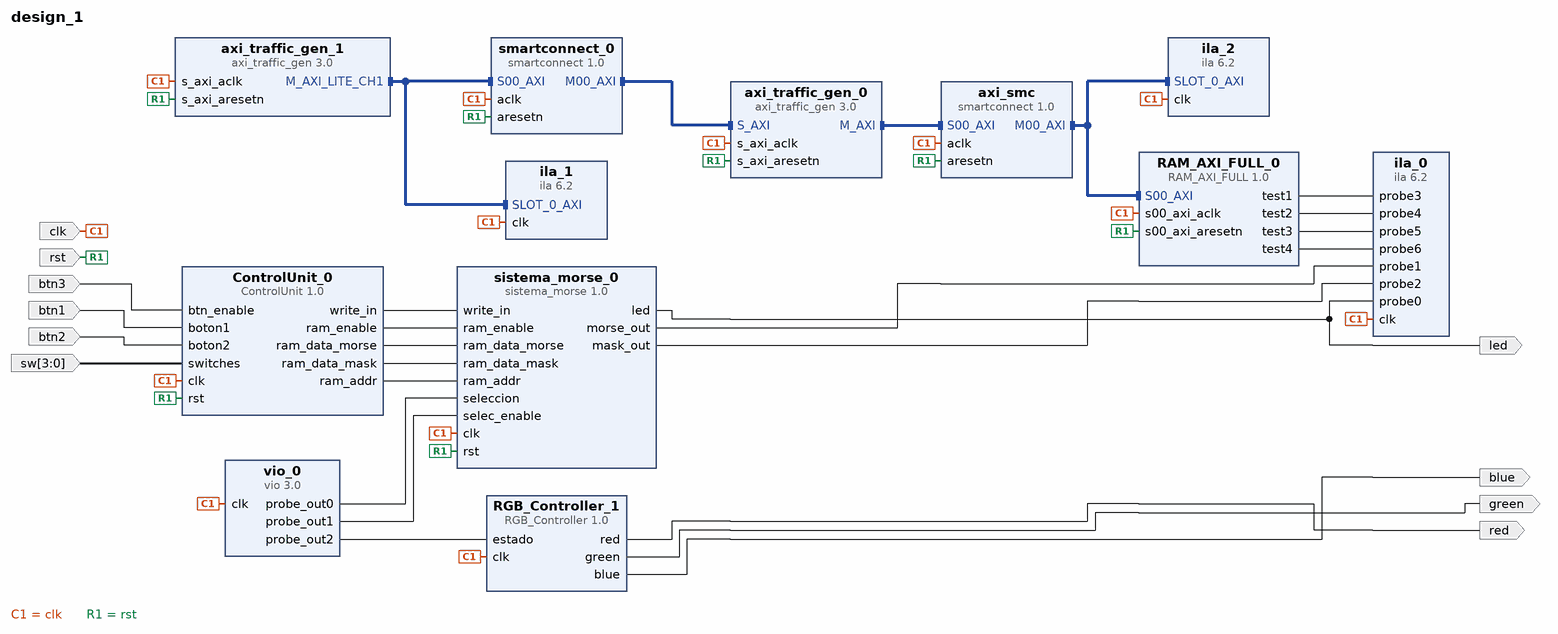
[diagram p0: block diagram of the top level]
# Vivado block design design_1, xc7z010clg400-1, Vivado 2020.1
create_bd_design design_1

create_bd_port -dir I -type clk clk
create_bd_port -dir I -type rst rst
create_bd_port -dir I btn3
create_bd_port -dir I btn1
create_bd_port -dir I btn2
create_bd_port -dir I -from 3 -to 0 sw
create_bd_port -dir O led
create_bd_port -dir O red
create_bd_port -dir O green
create_bd_port -dir O blue

create_bd_cell -type ip -vlnv xilinx.com:ip:vio:3.0 vio_0
set_property -dict [list \
  CONFIG.C_NUM_PROBE_IN 0 \
  CONFIG.C_NUM_PROBE_OUT 3 \
  CONFIG.C_PROBE_OUT0_WIDTH 6 \
  CONFIG.C_PROBE_OUT2_WIDTH 4 \
] [get_bd_cells vio_0]
create_bd_cell -type ip -vlnv xilinx.com:ip:ila:6.2 ila_0
set_property -dict [list \
  CONFIG.C_ENABLE_ILA_AXI_MON false \
  CONFIG.C_MONITOR_TYPE Native \
  CONFIG.C_NUM_OF_PROBES 7 \
  CONFIG.C_PROBE1_WIDTH 5 \
  CONFIG.C_PROBE2_WIDTH 5 \
  CONFIG.C_PROBE3_WIDTH 10 \
  CONFIG.C_PROBE4_WIDTH 10 \
  CONFIG.C_PROBE5_WIDTH 10 \
  CONFIG.C_PROBE6_WIDTH 10 \
] [get_bd_cells ila_0]
create_bd_cell -type ip -vlnv xilinx.com:ip:axi_traffic_gen:3.0 axi_traffic_gen_0
create_bd_cell -type ip -vlnv xilinx.com:ip:axi_traffic_gen:3.0 axi_traffic_gen_1
set_property -dict [list \
  CONFIG.C_ATG_MODE AXI4-Lite \
  CONFIG.C_ATG_SYSINIT_MODES System_Test \
  CONFIG.C_ATG_SYSTEM_CMD_MAX_RETRY 2147483647 \
  CONFIG.C_ATG_SYSTEM_INIT_ADDR_MIF ../../../../../../../support/addr.coe \
  CONFIG.C_ATG_SYSTEM_INIT_CTRL_MIF ../../../../../../../support/ctrl.coe \
  CONFIG.C_ATG_SYSTEM_INIT_DATA_MIF ../../../../../../../support/data.coe \
  CONFIG.C_ATG_SYSTEM_INIT_MASK_MIF ../../../../../../../support/mask.coe \
] [get_bd_cells axi_traffic_gen_1]
create_bd_cell -type ip -vlnv xilinx.com:ip:smartconnect:1.0 smartconnect_0
set_property -dict {CONFIG.NUM_SI 1} [get_bd_cells smartconnect_0]
create_bd_cell -type ip -vlnv xilinx.com:ip:ila:6.2 ila_1
create_bd_cell -type ip -vlnv xilinx.com:ip:smartconnect:1.0 axi_smc
set_property -dict {CONFIG.NUM_SI 1} [get_bd_cells axi_smc]
create_bd_cell -type ip -vlnv xilinx.com:user:RAM_AXI_FULL:1.0 RAM_AXI_FULL_0
create_bd_cell -type ip -vlnv xilinx.com:user:ControlUnit:1.0 ControlUnit_0
create_bd_cell -type ip -vlnv xilinx.com:user:RGB_Controller:1.0 RGB_Controller_1
create_bd_cell -type ip -vlnv xilinx.com:user:sistema_morse:1.0 sistema_morse_0
create_bd_cell -type ip -vlnv xilinx.com:ip:ila:6.2 ila_2

# ---- connections ----

connect_bd_intf_net [get_bd_intf_pins axi_traffic_gen_1/M_AXI_LITE_CH1] [get_bd_intf_pins smartconnect_0/S00_AXI]
connect_bd_intf_net [get_bd_intf_pins axi_traffic_gen_1/M_AXI_LITE_CH1] [get_bd_intf_pins ila_1/SLOT_0_AXI]
connect_bd_intf_net [get_bd_intf_pins smartconnect_0/M00_AXI] [get_bd_intf_pins axi_traffic_gen_0/S_AXI]
connect_bd_intf_net [get_bd_intf_pins axi_traffic_gen_0/M_AXI] [get_bd_intf_pins axi_smc/S00_AXI]
connect_bd_intf_net [get_bd_intf_pins axi_smc/M00_AXI] [get_bd_intf_pins RAM_AXI_FULL_0/S00_AXI]
connect_bd_intf_net [get_bd_intf_pins axi_smc/M00_AXI] [get_bd_intf_pins ila_2/SLOT_0_AXI]
connect_bd_net -net clk_0_1 [get_bd_ports clk] \
  [get_bd_pins vio_0/clk] [get_bd_pins ila_0/clk] [get_bd_pins axi_traffic_gen_1/s_axi_aclk] \
  [get_bd_pins smartconnect_0/aclk] [get_bd_pins axi_traffic_gen_0/s_axi_aclk] [get_bd_pins ila_1/clk] \
  [get_bd_pins axi_smc/aclk] [get_bd_pins RAM_AXI_FULL_0/s00_axi_aclk] [get_bd_pins ControlUnit_0/clk] \
  [get_bd_pins RGB_Controller_1/clk] [get_bd_pins sistema_morse_0/clk] [get_bd_pins ila_2/clk]
connect_bd_net -net rst_0_1 [get_bd_ports rst] \
  [get_bd_pins axi_traffic_gen_1/s_axi_aresetn] [get_bd_pins smartconnect_0/aresetn] \
  [get_bd_pins axi_traffic_gen_0/s_axi_aresetn] [get_bd_pins axi_smc/aresetn] [get_bd_pins RAM_AXI_FULL_0/s00_axi_aresetn] \
  [get_bd_pins ControlUnit_0/rst] [get_bd_pins sistema_morse_0/rst]
connect_bd_net -net btn_enable_0_1 [get_bd_ports btn3] [get_bd_pins ControlUnit_0/btn_enable]
connect_bd_net -net boton1_0_1 [get_bd_ports btn1] [get_bd_pins ControlUnit_0/boton1]
connect_bd_net -net boton2_0_1 [get_bd_ports btn2] [get_bd_pins ControlUnit_0/boton2]
connect_bd_net -net switches_0_1 [get_bd_ports sw] [get_bd_pins ControlUnit_0/switches]
connect_bd_net [get_bd_pins vio_0/probe_out0] [get_bd_pins sistema_morse_0/seleccion]
connect_bd_net [get_bd_pins vio_0/probe_out1] [get_bd_pins sistema_morse_0/selec_enable]
connect_bd_net [get_bd_pins ControlUnit_0/write_in] [get_bd_pins sistema_morse_0/write_in]
connect_bd_net [get_bd_pins ControlUnit_0/ram_enable] [get_bd_pins sistema_morse_0/ram_enable]
connect_bd_net [get_bd_pins ControlUnit_0/ram_data_morse] [get_bd_pins sistema_morse_0/ram_data_morse]
connect_bd_net [get_bd_pins ControlUnit_0/ram_data_mask] [get_bd_pins sistema_morse_0/ram_data_mask]
connect_bd_net [get_bd_pins ControlUnit_0/ram_addr] [get_bd_pins sistema_morse_0/ram_addr]
connect_bd_net [get_bd_pins sistema_morse_0/led] [get_bd_ports led] [get_bd_pins ila_0/probe0]
connect_bd_net [get_bd_pins sistema_morse_0/morse_out] [get_bd_pins ila_0/probe1]
connect_bd_net [get_bd_pins sistema_morse_0/mask_out] [get_bd_pins ila_0/probe2]
connect_bd_net [get_bd_pins RGB_Controller_1/red] [get_bd_ports red]
connect_bd_net [get_bd_pins RGB_Controller_1/green] [get_bd_ports green]
connect_bd_net [get_bd_pins RGB_Controller_1/blue] [get_bd_ports blue]
connect_bd_net [get_bd_pins vio_0/probe_out2] [get_bd_pins RGB_Controller_1/estado]
connect_bd_net [get_bd_pins RAM_AXI_FULL_0/test1] [get_bd_pins ila_0/probe3]
connect_bd_net [get_bd_pins RAM_AXI_FULL_0/test2] [get_bd_pins ila_0/probe4]
connect_bd_net [get_bd_pins RAM_AXI_FULL_0/test3] [get_bd_pins ila_0/probe5]
connect_bd_net [get_bd_pins RAM_AXI_FULL_0/test4] [get_bd_pins ila_0/probe6]

# ---- address map ----
assign_bd_address -offset 0x76000000 -range 64K -target_address_space [get_bd_addr_spaces axi_traffic_gen_0/Data] [get_bd_addr_segs RAM_AXI_FULL_0/S00_AXI/S00_AXI_mem]
assign_bd_address -offset 0x44A00000 -range 64K -target_address_space [get_bd_addr_spaces axi_traffic_gen_1/Reg1] [get_bd_addr_segs axi_traffic_gen_0/S_AXI/Reg0]

validate_bd_design
save_bd_design
